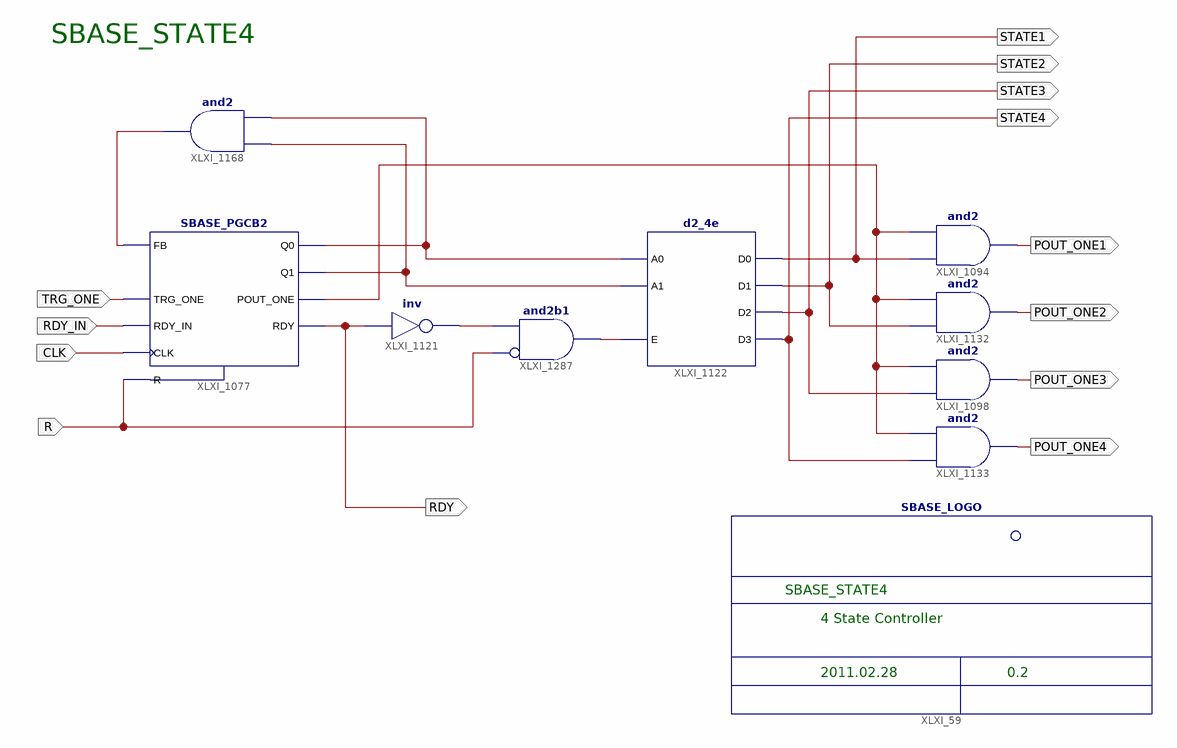
[diagram p0: schematic sheet 1]
// Xilinx ISE schematic SBASE_STATE4.sch (spartan3a) as structural Verilog: 10 symbols, 13 ports
module SBASE_STATE4 (
  input  R,
  input  TRG_ONE,
  input  RDY_IN,
  input  CLK,
  output POUT_ONE1,
  output POUT_ONE2,
  output POUT_ONE3,
  output POUT_ONE4,
  output STATE4,
  output STATE3,
  output STATE2,
  output STATE1,
  output RDY
);

  wire XLXN_2558, XLXN_2621, XLXN_2622, XLXN_2843, XLXN_2928, XLXN_2929;

  d2_4e XLXI_1122 (.A0(XLXN_2558), .A1(XLXN_2621), .E(XLXN_2929), .D0(STATE1), .D1(STATE2), .D2(STATE3), .D3(STATE4));
  and XLXI_1094 (POUT_ONE1, STATE1, XLXN_2843);
  and XLXI_1132 (POUT_ONE2, STATE2, XLXN_2843);
  and XLXI_1098 (POUT_ONE3, STATE3, XLXN_2843);
  and XLXI_1133 (POUT_ONE4, STATE4, XLXN_2843);
  and XLXI_1287 (XLXN_2929, ~R, XLXN_2928);  // and2b1
  SBASE_PGCB2 XLXI_1077 (
    .FB(XLXN_2622), .R(R), .CLK(CLK), .TRG_ONE(TRG_ONE), .RDY_IN(RDY_IN), .Q0(XLXN_2558), .Q1(XLXN_2621),
    .POUT_ONE(XLXN_2843), .RDY(RDY));
  and XLXI_1168 (XLXN_2622, XLXN_2621, XLXN_2558);
  not XLXI_1121 (XLXN_2928, RDY);
  SBASE_LOGO XLXI_59 ();

  // Notes on the sheet:
  //   SBASE_STATE4
  //   SBASE_STATE4
  //   4 State Controller
  //   2011.02.28
  //   0.2
endmodule
